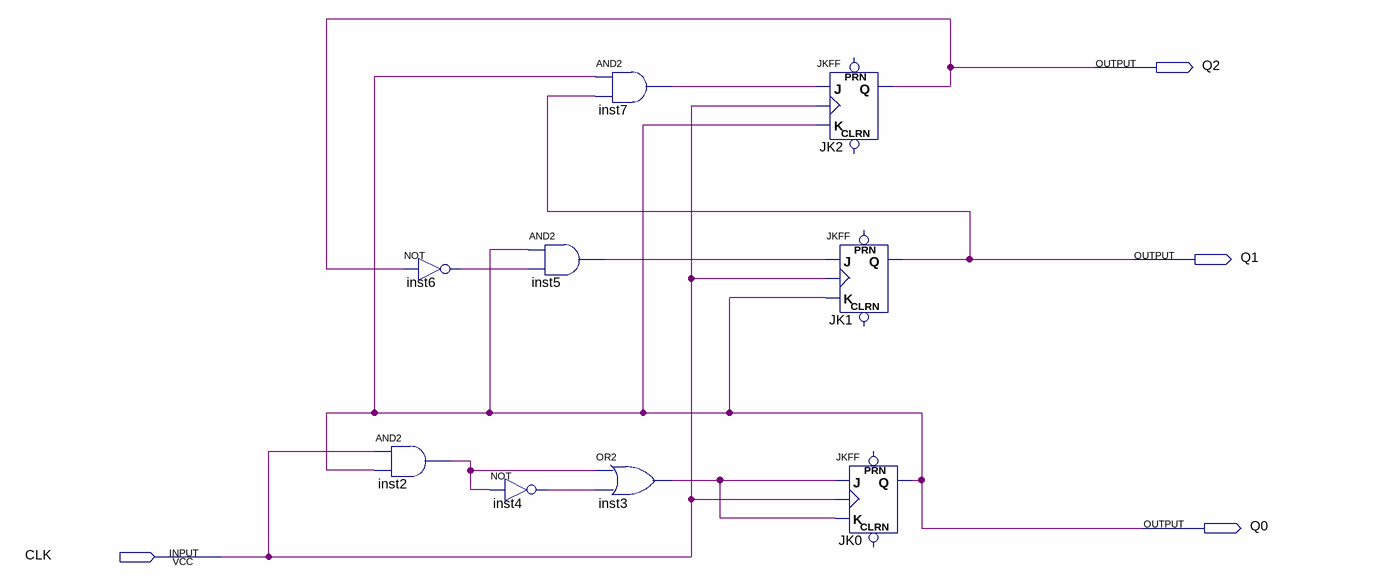
[diagram p0: schematic sheet]
// Quartus schematic mod6withCounter.bdf as structural Verilog: 9 symbols, 4 pins
module mod6withCounter (
  input  CLK,
  output Q2,
  output Q1,
  output Q0
);

  wire inst2_out, inst3_out, inst4_out, inst5_out, inst6_out, inst7_out;

  not inst6 (inst6_out, Q2);
  and inst2 (inst2_out, CLK, Q0);
  not inst4 (inst4_out, inst2_out);
  and inst5 (inst5_out, Q0, inst6_out);
  and inst7 (inst7_out, Q0, Q1);
  or inst3 (inst3_out, inst2_out, inst4_out);
  JKFF JK2 (.K(Q0), .J(inst7_out), .CLK(CLK), .Q(Q2));  // open: PRN, CLRN
  JKFF JK1 (.K(Q0), .J(inst5_out), .CLK(CLK), .Q(Q1));  // open: PRN, CLRN
  JKFF JK0 (.K(inst3_out), .J(inst3_out), .CLK(CLK), .Q(Q0));  // open: PRN, CLRN
endmodule
